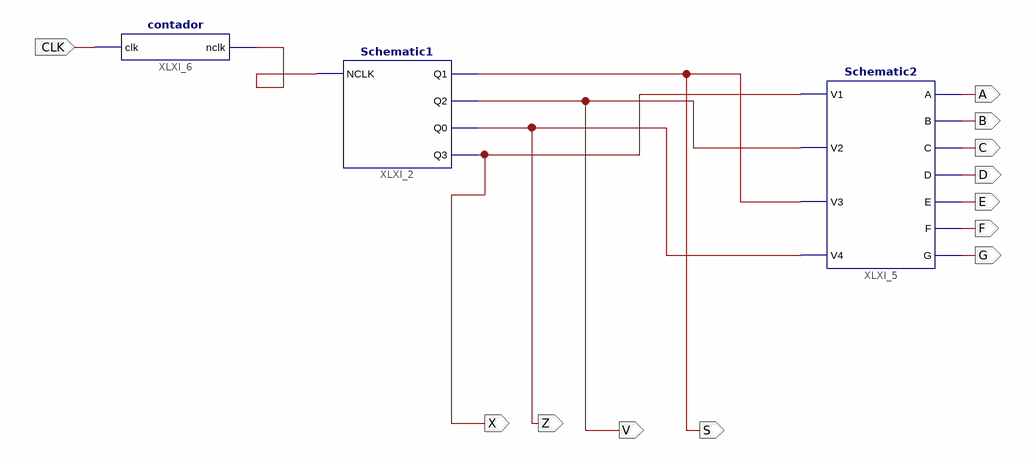
[diagram p0: schematic sheet 1]
// Xilinx ISE schematic Schematic.sch (spartan6) as structural Verilog: 3 symbols, 12 ports
module Schematic (
  input  CLK,
  output S,
  output V,
  output Z,
  output X,
  output A,
  output B,
  output C,
  output D,
  output E,
  output F,
  output G
);

  wire XLXN_10;

  Schematic1 XLXI_2 (.NCLK(XLXN_10), .Q1(S), .Q2(V), .Q0(Z), .Q3(X));
  Schematic2 XLXI_5 (.V1(X), .V2(V), .V3(S), .V4(Z), .A(A), .B(B), .C(C), .D(D), .E(E), .F(F), .G(G));
  contador XLXI_6 (.clk(CLK), .nclk(XLXN_10));
endmodule
